# EAGLE design Vjtronics wo GND (EAGLE 9.5.1)
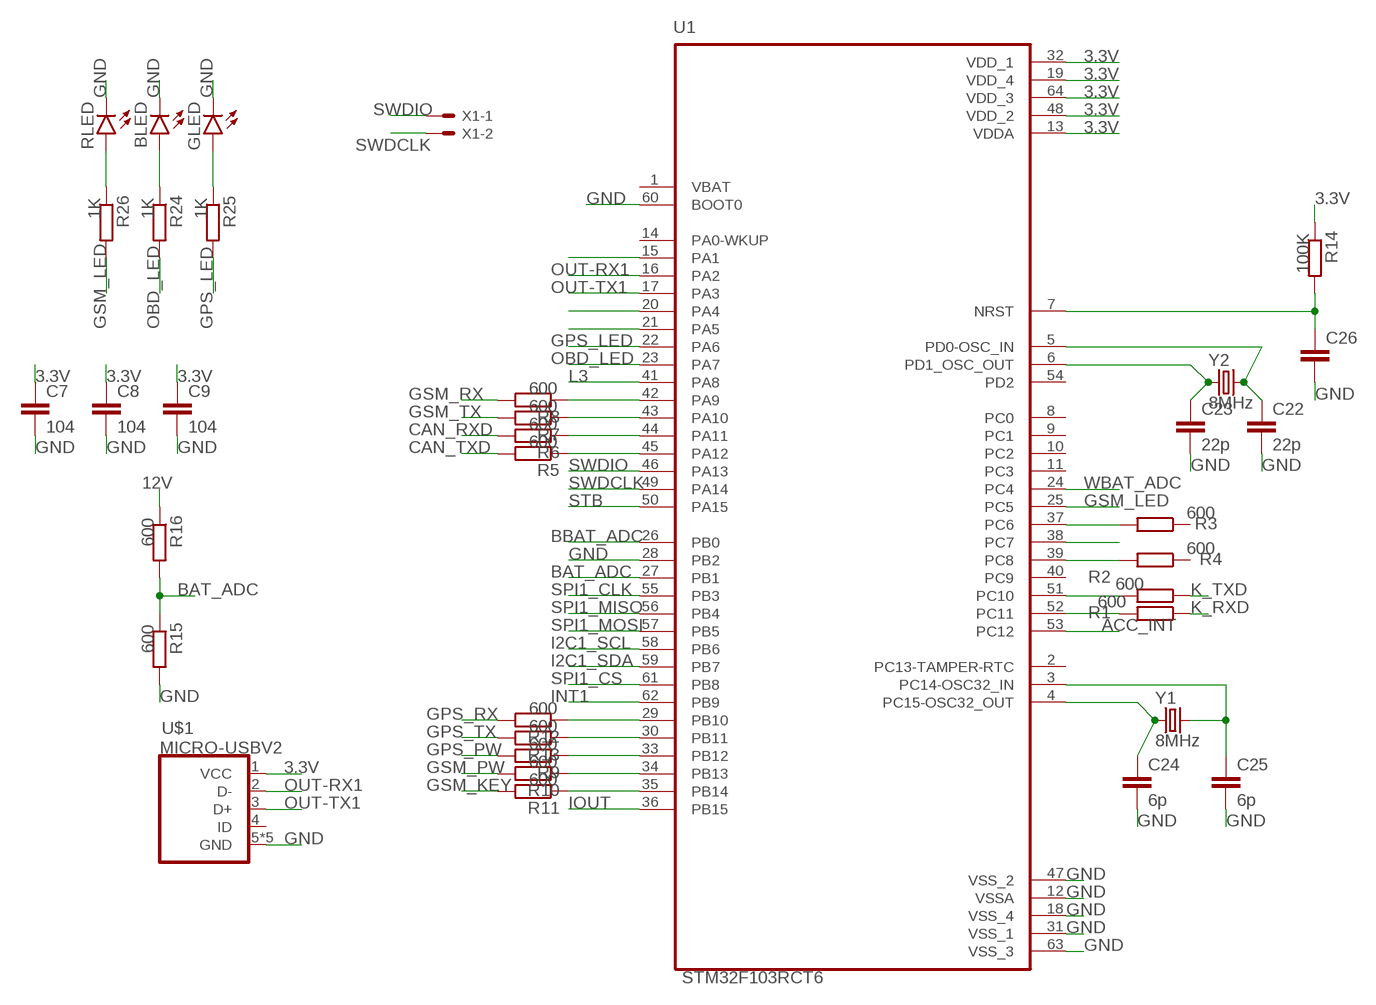
[diagram p0: schematic, sheet 1]

## Parts
BLED  LEDCHIPLED_0805  [CHIPLED_0805]
C7  104  C-EUC0805  [C0805]
C8  104  C-EUC0805  [C0805]
C9  104  C-EUC0805  [C0805]
C22  22p  C-EUC0805  [C0805]
C23  22p  C-EUC0805  [C0805]
C24  6p  C-EUC0805  [C0805]
C25  6p  C-EUC0805  [C0805]
C26  C-EUC0805  [C0805]
GLED  LEDCHIPLED_0805  [CHIPLED_0805]
R1  600  R-EU_M0805  [M0805]
R2  600  R-EU_M0805  [M0805]
R3  600  R-EU_M0805  [M0805]
R4  600  R-EU_M0805  [M0805]
R5  600  R-EU_M0805  [M0805]
R6  600  R-EU_M0805  [M0805]
R7  600  R-EU_M0805  [M0805]
R8  600  R-EU_M0805  [M0805]
R9  600  R-EU_M0805  [M0805]
R10  600  R-EU_M0805  [M0805]
R11  600  R-EU_M0805  [M0805]
R12  600  R-EU_M0805  [M0805]
R13  600  R-EU_M0805  [M0805]
R14  100K  R-EU_M0805  [M0805]
R15  600  R-EU_M0805  [M0805]
R16  600  R-EU_M0805  [M0805]
R24  1K  R-EU_M0805  [M0805]
R25  1K  R-EU_M0805  [M0805]
R26  1K  R-EU_M0805  [M0805]
RLED  LEDCHIPLED_0805  [CHIPLED_0805]
U1  STM32F103RCT6  [QFP50P1200X1200X160-64N]
U$1  MICRO-USBV2  [MICRO-USB-2]
X1  22-23-2021  [22-23-2021]
Y1  8MHz  CSM-7X-DU  [CSM-7X-DU]
Y2  8MHz  CSM-7X-DU  [CSM-7X-DU]

## Nets
3.3V: C7.1 C8.1 C9.1 R14.1 U1.13(VDDA) U1.19(VDD_4) U1.32(VDD_1) U1.48(VDD_2) U1.64(VDD_3) U$1.1(VCC)
12V: R16.1
ACC_INT: U1.53(PC12)
BAT_ADC: R15.1 R16.2 U1.27(PB1)
BBAT_ADC: U1.26(PB0)
CAN_RXD: R6.2
CAN_TXD: R5.2
GND: BLED.C C7.2 C8.2 C9.2 C22.2 C23.2 C24.2 C25.2 C26.2 GLED.C R15.2 RLED.C U1.12(VSSA) U1.18(VSS_4) U1.28(PB2) U1.31(VSS_1) U1.47(VSS_2) U1.60(BOOT0) U1.63(VSS_3) U$1.5(GND) U$1.P$1(GND) U$1.P$2(GND) U$1.P$3(GND) U$1.P$4(GND)
GPS_LED: R25.2 U1.22(PA6)
GPS_PW: R9.2
GPS_RX: R12.2
GPS_TX: R13.2
GSM_KEY: R11.2
GSM_LED: R26.2 U1.25(PC5)
GSM_PW: R10.2
GSM_RX: R8.2
GSM_TX: R7.2
I2C1_SCL: U1.58(PB6)
I2C1_SDA: U1.59(PB7)
INT1: U1.62(PB9)
IOUT: U1.36(PB15)
K_RXD: R1.1
K_TXD: R2.1
L3: U1.41(PA8)
N$1: R13.1 U1.30(PB11)
N$2: R5.1 U1.45(PA12)
N$3: R6.1 U1.44(PA11)
N$4: R7.1 U1.43(PA10)
N$5: R8.1 U1.42(PA9)
N$6: R1.2 U1.52(PC11)
N$7: R2.2 U1.51(PC10)
N$8: R12.1 U1.29(PB10)
N$9: R4.2 U1.39(PC8)
N$10: U1.38(PC7)
N$11: R3.2 U1.37(PC6)
N$12: U1.15(PA1)
N$13: R11.1 U1.35(PB14)
N$14: R10.1 U1.34(PB13)
N$15: R9.1 U1.33(PB12)
N$16: C23.1 U1.6(PD1_OSC_OUT) Y2.1
N$17: C26.1 R14.2 U1.7(NRST)
N$18: C22.1 U1.5(PD0-OSC_IN) Y2.2
N$19: C24.1 U1.4(PC15-OSC32_OUT) Y1.1
N$20: C25.1 U1.3(PC14-OSC32_IN) Y1.2
N$21: R26.1 RLED.A
N$22: U1.21(PA5)
N$23: U1.20(PA4)
N$24: BLED.A R24.1
N$25: GLED.A R25.1
OBD_LED: R24.2 U1.23(PA7)
OUT-RX1: U1.16(PA2) U$1.2(D-)
OUT-TX1: U1.17(PA3) U$1.3(D+)
SPI1_CLK: U1.55(PB3)
SPI1_CS: U1.61(PB8)
SPI1_MISO: U1.56(PB4)
SPI1_MOSI: U1.57(PB5)
STB: U1.50(PA15)
SWDCLK: U1.49(PA14) X1.2
SWDIO: U1.46(PA13) X1.1
WBAT_ADC: U1.24(PC4)
Unconnected: R3.1 R4.1 U1.1(VBAT) U1.2(PC13-TAMPER-RTC) U1.8(PC0) U1.9(PC1) U1.10(PC2) U1.11(PC3) U1.14(PA0-WKUP) U1.40(PC9) U1.54(PD2) U$1.4(ID)

## Library data of the parts
BLED GLED RLED = led:LED: LED OSRAM: - CHIPLED LG R971, LG N971, LY N971, LG Q971, LY Q971, LO R971, LY R971 LH N974, LH R974 LS Q976, LO Q976, LY Q976 LO Q996 - Hyper CHIPLED LW Q18S LB Q993, LB Q99A, LB R99A - SideLED LS A670, LO A670, LY A670, LG A670, LP A670 LB A673, LV A673, LT A673, LW A673 LH A674 LY A675 LS A676, LA A676, LO A676, LY A676, LW A676 LS A679, LY A679, LG A679 - Hyper Micro SIDELED® LS Y876, LA Y876, LO Y876, LY Y876 LT Y87S - SmartLED LW L88C, LW L88S LB L89C, LB L89S, LG L890 LS L89K, LO L89K, LY L89K LS L896, LA L896, LO L896, LY L896 - TOPLED LS T670, LO T670, LY T670, LG T670, LP T670 LSG T670, LSP T670, LSY T670, LOP T670, LYG T670 LG T671, LOG T671, LSG T671 LB T673, LV T673, LT T673, LW T673 LH T674 LS T676, LA T676, LO T676, LY T676, LB T676, LH T676, LSB T676, LW T676 LB T67C, LV T67C, LT T67C, LS T67K, LO T67K, LY T67K, LW E67C LS E67B, LA E67B, LO E67B, LY E67B, LB E67C, LV E67C, LT E67C LW T67C LS T679, LY T679, LG T679 LS T770, LO T770, LY T770, LG T770, LP T770 LB T773, LV T773, LT T773, LW T773 LH T774 LS E675, LA E675, LY E675, LS T675 LS T776, LA T776, LO T776, LY T776, LB T776 LHGB T686 LT T68C, LB T68C - Hyper Mini TOPLED® LB M676 - Mini TOPLED Santana® LG M470 LS M47K, LO M47K, LY M47K Source: http://www.osram.convergy.de LUXEON: - LUMILED® LXK2-PW12-R00, LXK2-PW12-S00, LXK2-PW14-U00, LXK2-PW14-V00 LXK2-PM12-R00, LXK2-PM12-S00, LXK2-PM14-U00 LXK2-PE12-Q00, LXK2-PE12-R00, LXK2-PE12-S00, LXK2-PE14-T00, LXK2-PE14-U00 LXK2-PB12-K00, LXK2-PB12-L00, LXK2-PB12-M00, LXK2-PB14-N00, LXK2-PB14-P00, LXK2-PB14-Q00 LXK2-PR12-L00, LXK2-PR12-M00, LXK2-PR14-Q00, LXK2-PR14-R00 LXK2-PD12-Q00, LXK2-PD12-R00, LXK2-PD12-S00 LXK2-PH12-R00, LXK2-PH12-S00 LXK2-PL12-P00, LXK2-PL12-Q00, LXK2-PL12-R00 Source: www.luxeon.com KINGBRIGHT: KA-3528ASYC Source: www.kingbright.com
C7-C9 C22-C26 = rcl:C-EU: CAPACITOR, European symbol; SPICEPREFIX: C
R1-R16 R24-R26 = resistor:R-EU_: RESISTOR, European symbol
U1 = STM32F103RCT6:STM32F103RCT6: ARM-based 32-bit MCU Check prices <https://pricing.snapeda.com/parts/STM32F103RCT6/STMicroelectronics/view-part?ref=eda>; AVAILABILITY: Warning; DESCRIPTION: ARM® Cortex®-M3 STM32F1 Microcontroller IC 32-Bit 72MHz 256KB (256K x 8) FLASH 64-LQFP (10x10); MF: STMicroelectronics; MP: STM32F103RCT6; PACKAGE: LQFP-64 STMicroelectronics; PRICE: None; PURCHASE-URL: https://pricing.snapeda.com/search/part/STM32F103RCT6/?ref=eda
U$1 = MicroUSB:MICRO-USB: Micro USB B connector
X1 = con-molex:22-23-2021: .100" (2.54mm) Center Header - 2 Pin
Y1 Y2 = crystal:CSM-7X-DU: SMD CRYSTAL Source: www.ecsxtal.com .. Crystal 3.6864MHz CSM_7X_DU.PDF; OC_FARNELL: unknown; OC_NEWARK: unknown

## Board
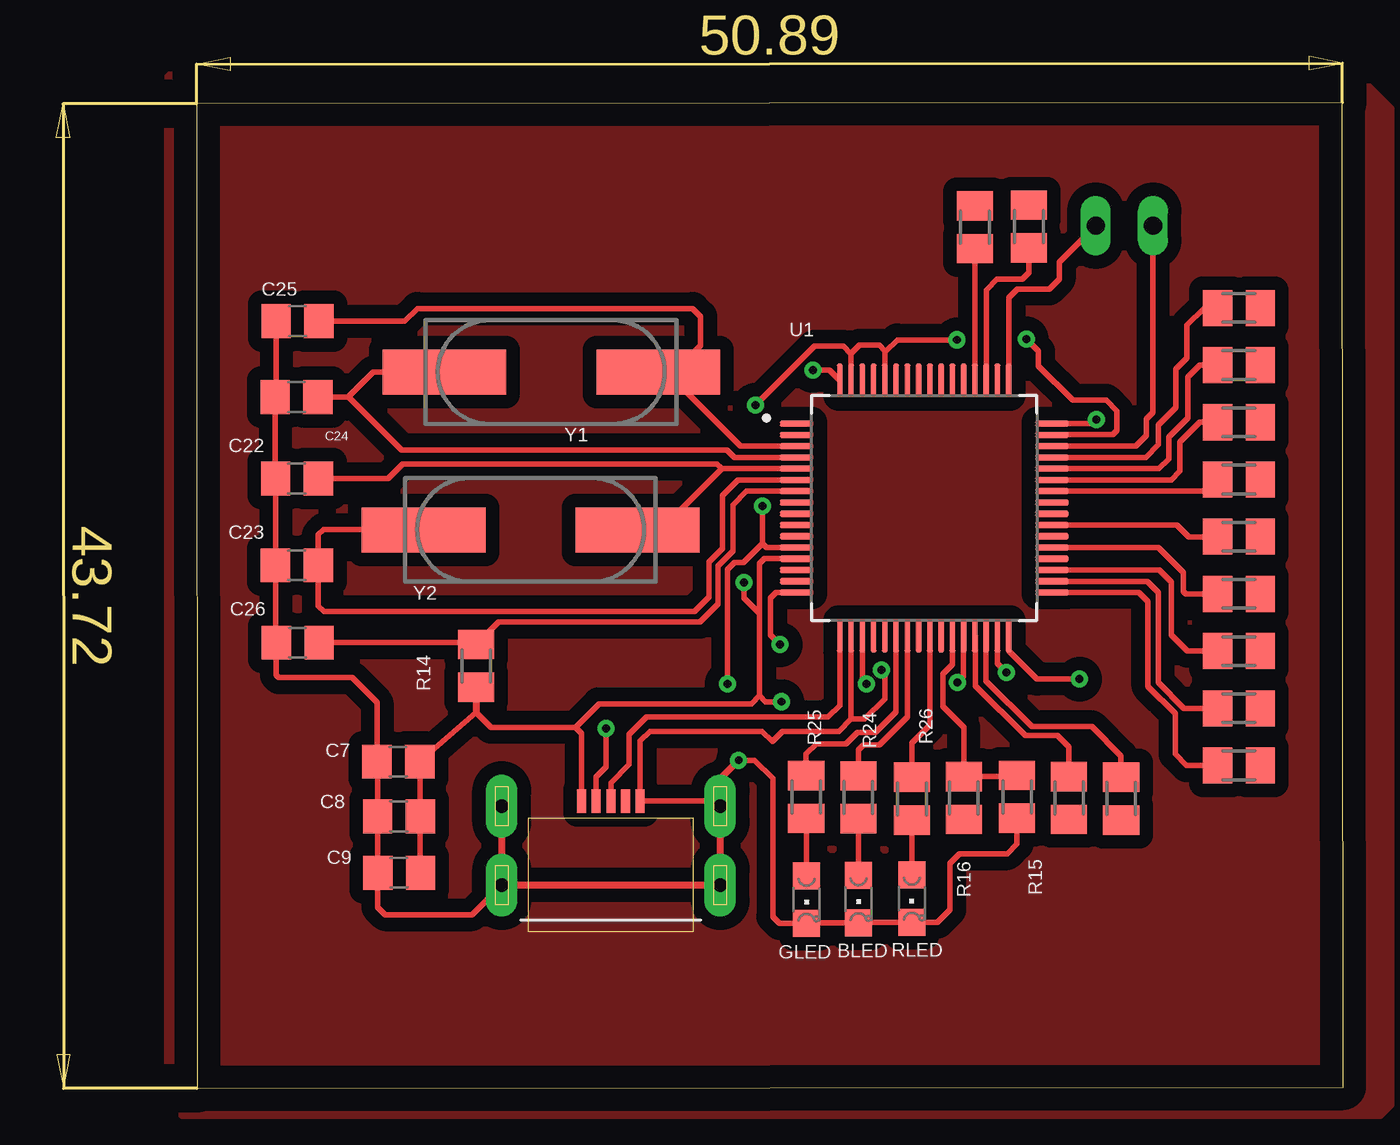
[diagram p1: board, top side]
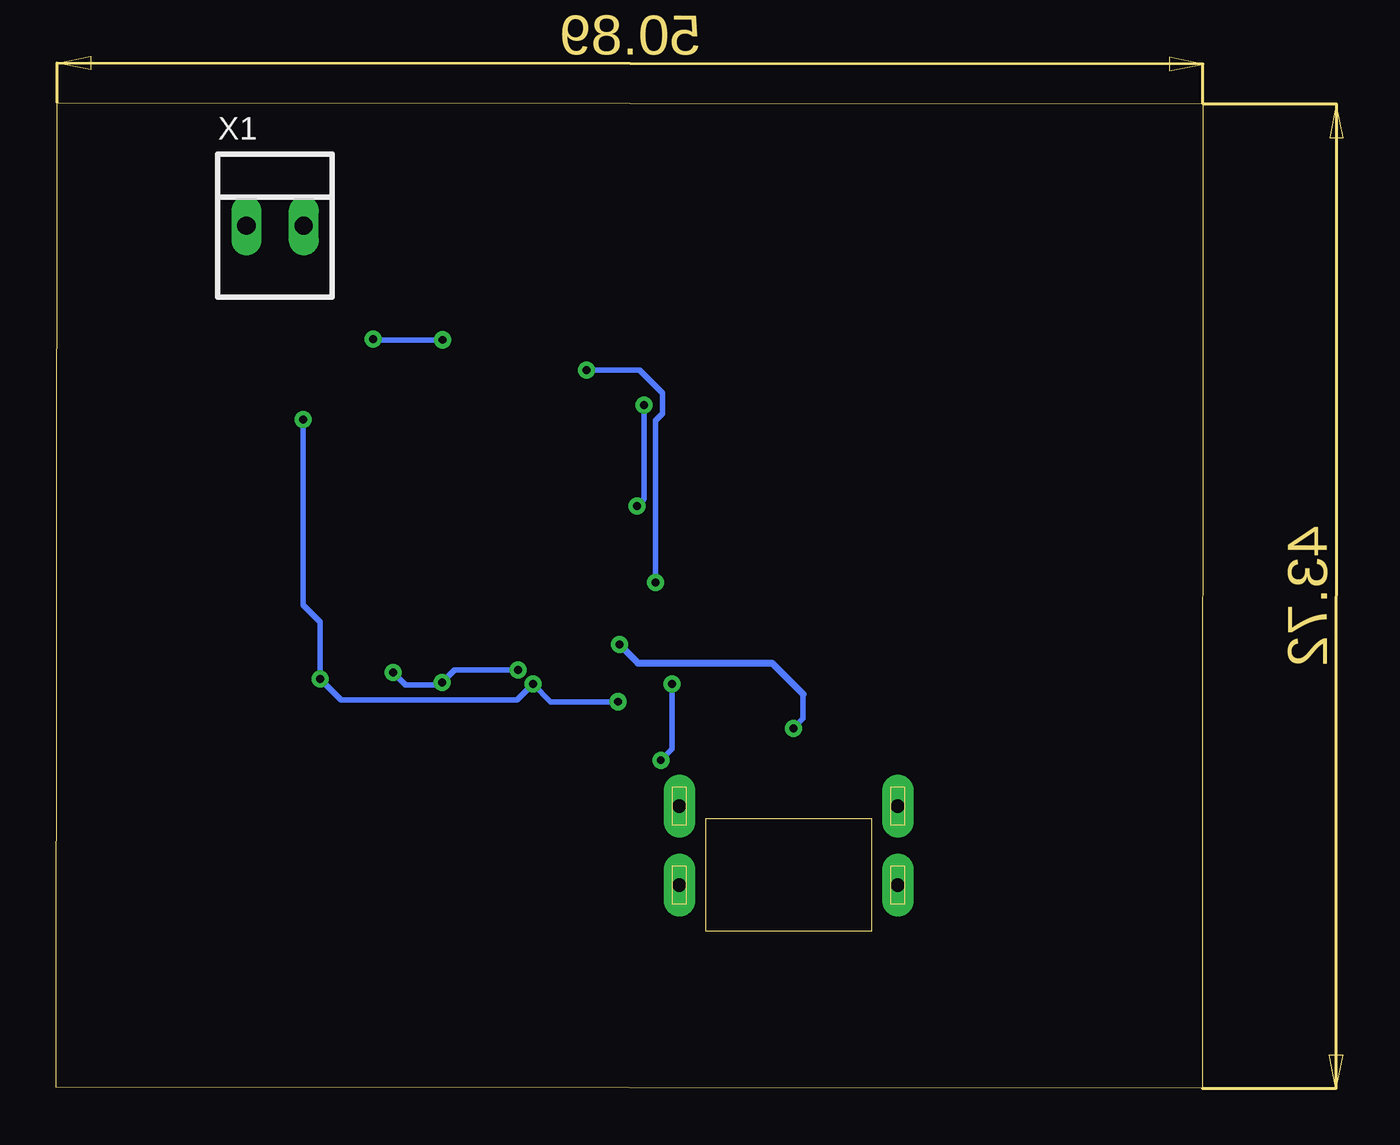
[diagram p2: board, bottom side, seen from below]

Size 50.92 x 43.77 mm. Coordinates in mm from the lower left corner, seen from the top.
Outline: 0.03,0 50.92,0.05 50.89,43.77 0,43.72 0.03,0
Copper layers (1*16): Top 0.035mm / dielectric 1.5mm / Bottom 0.035mm
Design rules "default": minimum track width 6mil, minimum drill 0.35mm, track to track 6mil, track to pad 6mil, pad to pad 6mil, via to via 6mil, smd to smd 6mil, copper to edge 40mil, drill to drill 6mil, minimum pad ring 10mil, minimum via ring 8mil, stop-mask expansion 4mil, vias tented up to drill 0mil, thermal gap 10mil

### Footprints (pad centres in the part's own frame; a part is rotated, then mirrored left to right if it is on the bottom)
CHIPLED_0805 = smd 1.2 x 1.2: A 0,-1.05; C 0,1.05
C0805 = smd 1.3 x 1.5: 1 -0.95,0; 2 0.95,0
M0805 = smd 1.3 x 1.6: 1 -0.95,0; 2 0.95,0
QFP50P1200X1200X160-64N = smd 1.49 x 0.28: 1 -5.67,3.75; 2 -5.67,3.25; 3 -5.67,2.75; 4 -5.67,2.25; 5 -5.67,1.75; 6 -5.67,1.25; 7 -5.67,0.75; 8 -5.67,0.25; 9 -5.67,-0.25; 10 -5.67,-0.75; 11 -5.67,-1.25; 12 -5.67,-1.75; 13 -5.67,-2.25; 14 -5.67,-2.75; 15 -5.67,-3.25; 16 -5.67,-3.75; 33 5.67,-3.75; 34 5.67,-3.25; 35 5.67,-2.75; 36 5.67,-2.25; 37 5.67,-1.75; 38 5.67,-1.25; 39 5.67,-0.75; 40 5.67,-0.25; 41 5.67,0.25; 42 5.67,0.75; 43 5.67,1.25; 44 5.67,1.75; 45 5.67,2.25; 46 5.67,2.75; 47 5.67,3.25; 48 5.67,3.75 | smd 0.28 x 1.49: 17 -3.75,-5.67; 18 -3.25,-5.67; 19 -2.75,-5.67; 20 -2.25,-5.67; 21 -1.75,-5.67; 22 -1.25,-5.67; 23 -0.75,-5.67; 24 -0.25,-5.67; 25 0.25,-5.67; 26 0.75,-5.67; 27 1.25,-5.67; 28 1.75,-5.67; 29 2.25,-5.67; 30 2.75,-5.67; 31 3.25,-5.67; 32 3.75,-5.67; 49 3.75,5.67; 50 3.25,5.67; 51 2.75,5.67; 52 2.25,5.67; 53 1.75,5.67; 54 1.25,5.67; 55 0.75,5.67; 56 0.25,5.67; 57 -0.25,5.67; 58 -0.75,5.67; 59 -1.25,5.67; 60 -1.75,5.67; 61 -2.25,5.67; 62 -2.75,5.67; 63 -3.25,5.67; 64 -3.75,5.67
MICRO-USB-2 = smd 0.4 x 1.05: 1 -1.3,5.275; 2 -0.65,5.275; 3 0,5.275; 4 0.65,5.275; 5 1.3,5.275 | drill 0.6 pad 1.4 long: P$1 -4.85,5.05; P$2 -4.85,1.55; P$3 4.85,5.05; P$4 4.85,1.55
22-23-2021 = drill 0.813 long: 1 -1.27,0; 2 1.27,0
CSM-7X-DU = smd 5.5 x 2: 1 -4.75,0; 2 4.75,0

### Placement (x,y rotation side)
BLED  29.4,8.4 180 top
C7  8.96,14.51 180 top
C8  8.99,12.07 180 top
C9  9,9.57 180 top
C22  4.46,27.08 180 top
C23  4.46,23.23 180 top
C24  4.44,30.7 180 top
C25  4.49,34.07 180 top
C26  4.5,19.79 180 top
GLED  27.09,8.37 180 top
R1  34.57,38.23 270 top
R2  36.96,38.27 270 top
R3  46.29,21.96 180 top
R4  46.29,24.5 180 top
R5  46.29,34.66 0 top
R6  46.29,32.12 0 top
R7  46.29,29.58 0 top
R8  46.29,27.04 0 top
R9  46.29,14.34 0 top
R10  46.29,16.88 0 top
R11  46.29,19.42 0 top
R12  38.75,12.89 270 top
R13  41.06,12.86 270 top
R14  12.42,18.76 90 top
R15  36.44,12.94 270 top
R16  34.07,12.89 90 top
R24  29.39,12.92 90 top
R25  27.08,12.93 90 top
R26  31.77,12.86 90 top
RLED  31.77,8.42 180 top
U1  32.32,25.77 0 top
U$1  18.4,7.48 0 top
X1  41.21,38.31 0 bottom
Y1  15.75,31.8 0 top
Y2  14.84,24.8 0 top

### Tracks (layer width: path | path; a pad name or v marks a point on that pad's centre or on a via)
3.3V  (via drill 0.35)
  Top 0.254: C7.1 12.42,16.69 13.08,16.03 16.83,16.03 | U1.13 25.22,23.52 25,23.3 25,21.09 | 25,21.09 25,17.44 | 25,17.44 24.63,17.07 17.88,17.07 16.83,16.03 | U1.19 29.57,18.13 v29.75,17.95 | v25.98,17.17 25.27,17.17 25,17.44 | v39.2,18.17 37.33,18.17 36.07,19.43 U1.32 | v39.96,29.69 39.78,29.52 U1.48 | v27.37,31.89 28.11,31.89 U1.64 | v24.31,22.45 24.31,21.78 25,21.09 | 9.94,9.59 C8.1 9.94,14.48 | 16.83,16.03 17.1,15.76 U$1.1
  Top 0.305: R14.1 12.42,16.69 | C9.1 9.94,9.59 | 9.94,14.48 C7.1
  Bottom 0.254: v25.98,17.17 28.97,17.17 v29.75,17.95 30.47,17.23 38.27,17.23 v39.2,18.17 39.2,20.72 39.96,21.47 v39.96,29.69 | v24.31,22.45 24.31,29.66 24,29.97 24,30.87 25.02,31.89 v27.37,31.89
BAT_ADC
  Top 0.254: R15.1 36.39,13.84 R16.2 34.07,16.03 33.14,16.96 33.14,18.4 33.57,18.83 U1.27
GND  (via drill 0.35)
  Top 0.254: 29.42,7.37 RLED.C 32.91,7.37 33.45,7.92 33.45,9.98 33.89,10.42 36,10.42 36.44,10.85 R15.2 | BLED.C 27.11,7.35 | GLED.C 25.89,7.32 25.59,7.62 25.59,13.75 24.77,14.57 v24.08,14.57 | 29.07,16.4 28.52,15.86 26.03,15.86 25.58,15.4 25.12,15.86 20.14,15.86 19.7,15.42 U$1.5 23.02,12.75 U$1.P$3 | U1.18 29.07,16.4 | U1.12 25.32,24.02 25.13,24.2 | 25.13,24.2 v25.13,25.86 | v24.81,30.34 27.43,32.96 28.72,32.96 29.07,32.61 | U1.63 29.07,32.61 | 29.07,32.61 29.07,32.63 29.43,32.99 30.32,32.99 30.57,32.74 | 30.57,32.74 U1.60 | 30.57,32.74 30.62,32.74 31.12,33.24 v33.77,33.24 | U1.47 40.68,29.02 40.88,29.22 40.88,30.07 40.39,30.55 38.91,30.55 37.4,32.07 37.4,32.73 v36.85,33.28 | U1.31 35.57,18.87 v35.97,18.46 | 29.07,16.4 29.67,16.4 30.56,17.29 30.56,18.43 v30.41,18.58 | U1.28 34.07,18.29 v33.8,18.02 | 25.13,24.2 | v23.58,17.96 23.58,23.04 23.9,23.36 24.29,23.36 25.13,24.2 | C25.2 3.54,30.85 | C24.2 3.49,27.1 | C22.2 C23.2 | C23.2 3.51,19.83 | 8.04,14.48 C8.2 8.04,9.59 | C26.2 3.55,18.35 3.66,18.24 6.91,18.24 8.01,17.13 C7.2 | C9.2 8.05,8.04 8.39,7.71 12.23,7.71 U$1.P$2
  Top 0.305: 29.42,7.37 BLED.C | 27.11,7.35 GLED.C | C24.2 3.4,30.71 3.54,30.85 | 3.49,27.1 C22.2 | C23.2 | 3.51,19.83 C26.2 | C7.2 8.04,14.48 | 8.04,9.59 C9.2 | v24.08,14.57 23.25,13.74 U$1.P$3 U$1.P$4 U$1.P$2 U$1.P$1
  Bottom 0.254: v24.81,30.34 24.81,26.18 v25.13,25.86 | v33.77,33.24 36.81,33.24 v36.85,33.28 | v35.97,18.46 35.41,17.91 33.91,17.91 v33.8,18.02 33.24,18.58 v30.41,18.58 | v23.58,17.96 23.58,15.07 v24.08,14.57
GND2
  pour Top (isolate 0.61): -1.33,44.88 -1.33,-0.55 -0.64,-1.24 52.56,-1.24 53.07,-0.73 53.07,43.5 51.52,45.05 -1.18,45.05 -1.32,44.91
GPS_LED
  Top 0.254: U1.22 31.07,16.72 30.14,15.8 29.34,15.8 28.84,15.3 27.52,15.3 27.08,14.85 R25.2
GSM_LED
  Top 0.254: U1.25 32.57,16.14 31.77,15.34 R26.2
N$1
  Top 0.254: U1.30 35.06,18.1 37.09,16.07 39.76,16.07 41.06,14.77 R13.1
N$2
  Top 0.254: U1.45 42.15,28.02 42.72,28.58 42.72,29.44 43.5,30.22 43.5,31.93 43.98,32.42 43.98,33.89 44.75,34.66 R5.1
N$3
  Top 0.254: U1.44 42.74,27.52 43.18,27.95 43.18,28.91 44.02,29.76 44.02,31.58 44.56,32.12 R6.1
N$4
  Top 0.254: U1.43 43.28,27.02 43.68,27.41 43.68,28.71 44.55,29.58 R7.1
N$5
  Top 0.254: U1.42 44.82,26.52 R8.1
N$6
  Top 0.254: U1.52 R1.2
N$7
  Top 0.254: U1.51 35.07,35.44 35.55,35.92 36.67,35.92 36.97,36.22 R2.2
N$8
  Top 0.254: U1.29 34.59,20.07 34.59,17.87 36.8,15.66 38.23,15.66 38.73,15.16 38.73,13.86 R12.1
N$9
  Top 0.254: U1.39 43.54,25.02 44.08,24.48 45.32,24.48 R4.2
N$11
  Top 0.254: U1.37 42.71,24.02 43.81,22.92 43.81,22.07 43.93,21.96 R3.2
N$13
  Top 0.254: R11.1 44,19.42 43.3,20.12 43.3,22.49 42.77,23.02 U1.35
N$14
  Top 0.254: R10.1 43.85,16.88 42.71,18.02 42.71,22.03 42.22,22.52 U1.34
N$15
  Top 0.254: R9.1 43.97,14.34 43.46,14.84 43.46,16.64 42.25,17.85 42.25,21.62 41.85,22.02 U1.33
N$16
  Top 0.254: U1.6 24.05,27.02 23.36,26.32 23.36,23.97 22.76,23.37 22.76,21.82 22.11,21.17 5.66,21.17 5.41,21.42 C23.1 5.41,24.58 5.64,24.82 10.07,24.82 Y2.1
N$17
  Top 0.254: U1.7 24.43,26.52 23.82,25.9 23.82,23.85 23.17,23.2 23.17,21.52 23.1,21.45 22.35,20.7 13.41,20.7 R14.2 | C26.1 12.33,19.79
  Top 0.305: 12.33,19.79 R14.2
N$18
  Top 0.254: Y2.2 20.61,24.8 23.33,27.52 | C22.1 8.5,27.08 9.15,27.73 23.12,27.73 23.33,27.52 | U1.5 23.33,27.52
N$19
  Top 0.254: U1.4 23.89,28.02 23.56,28.35 9.11,28.35 6.76,30.7 6.74,30.7 | C24.1 6.66,30.7 6.74,30.7 | Y1.1 7.84,31.8 6.74,30.7
N$20
  Top 0.254: U1.3 24.16,28.52 20.87,31.8 Y1.2 | C25.1 9.25,34.07 9.81,34.64 22.03,34.64 22.38,34.28 22.38,32.99 21.2,31.8
  Top 0.305: 21.2,31.8 Y1.2
N$21
  Top 0.254: RLED.A R26.1
N$24
  Top 0.254: BLED.A 29.38,9.46 R24.1
N$25
  Top 0.254: R25.1 27.09,11.97 GLED.A
OBD_LED
  Top 0.254: U1.23 31.57,16.5 30.32,15.26 29.62,15.26 29.38,15.02 R24.2
OUT-RX1  (via drill 0.35)
  Top 0.254: U1.16 25.73,22.02 25.48,21.77 25.48,20.13 v25.91,19.7 | v18.19,15.99 18.19,14.26 17.75,13.83 U$1.2
  Bottom 0.254: 17.76,17.51 17.76,16.42 v18.19,15.99
  Bottom 0.305: v25.91,19.7 25.1,18.89 19.13,18.89 17.76,17.51
OUT-TX1
  Top 0.254: U1.17 28.57,17 28.05,16.48 19.99,16.48 19.22,15.71 19.22,14.39 18.4,13.57 U$1.3
SWDCLK
  Top 0.254: X1.2 38.31,36.68 38.31,35.94 37.86,35.5 36.45,35.5 36.07,35.11 U1.49
SWDIO
  Top 0.254: X1.1 42.48,30.01 42.18,29.71 42.18,28.98 41.72,28.52 U1.46